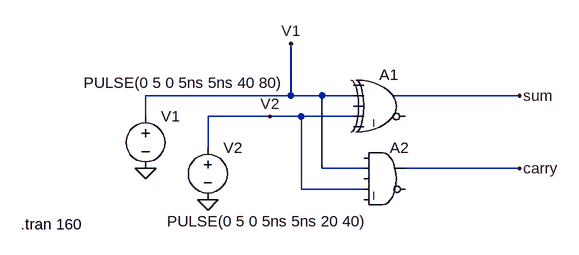
[diagram p0: schematic Half Adder.asc]
Half Adder.asc, the LTspice schematic file:
Version 4
SHEET 1 880 680
WIRE 272 64 272 -16
WIRE 272 64 48 64
WIRE 320 64 272 64
WIRE 368 64 320 64
WIRE 624 64 432 64
WIRE 48 96 48 64
WIRE 240 96 144 96
WIRE 288 96 240 96
WIRE 368 96 288 96
WIRE 144 144 144 96
WIRE 320 176 320 64
WIRE 384 176 320 176
WIRE 624 176 448 176
WIRE 288 208 288 96
WIRE 384 208 288 208
FLAG 144 224 0
FLAG 48 176 0
FLAG 624 64 sum
FLAG 624 176 carry
FLAG 272 -16 V1
FLAG 240 96 V2
SYMBOL voltage 48 80 R0
WINDOW 3 -95 -36 Left 2
WINDOW 123 0 0 Left 0
WINDOW 39 0 0 Left 0
SYMATTR InstName V1
SYMATTR Value PULSE(0 5 0 5ns 5ns 40 80)
SYMBOL voltage 144 128 R0
WINDOW 3 -63 129 Left 2
WINDOW 123 0 0 Left 0
WINDOW 39 0 0 Left 0
SYMATTR InstName V2
SYMATTR Value PULSE(0 5 0 5ns 5ns 20 40)
SYMBOL Digital\\xor 416 16 R0
SYMATTR InstName A1
SYMBOL Digital\\and 416 128 R0
SYMATTR InstName A2
TEXT -144 262 Left 2 !.tran 160

The netlist it stands for:
* Half Adder.asc
V1 V1 0 PULSE(0 5 0 5ns 5ns 40 80)
V2 V2 0 PULSE(0 5 0 5ns 5ns 20 40)
A1 0 V1 0 V2 0 0 sum 0 XOR
A2 0 V1 0 V2 0 0 carry 0 AND
.tran 160
.backanno
.end